# Altium project Piano.PrjPcb
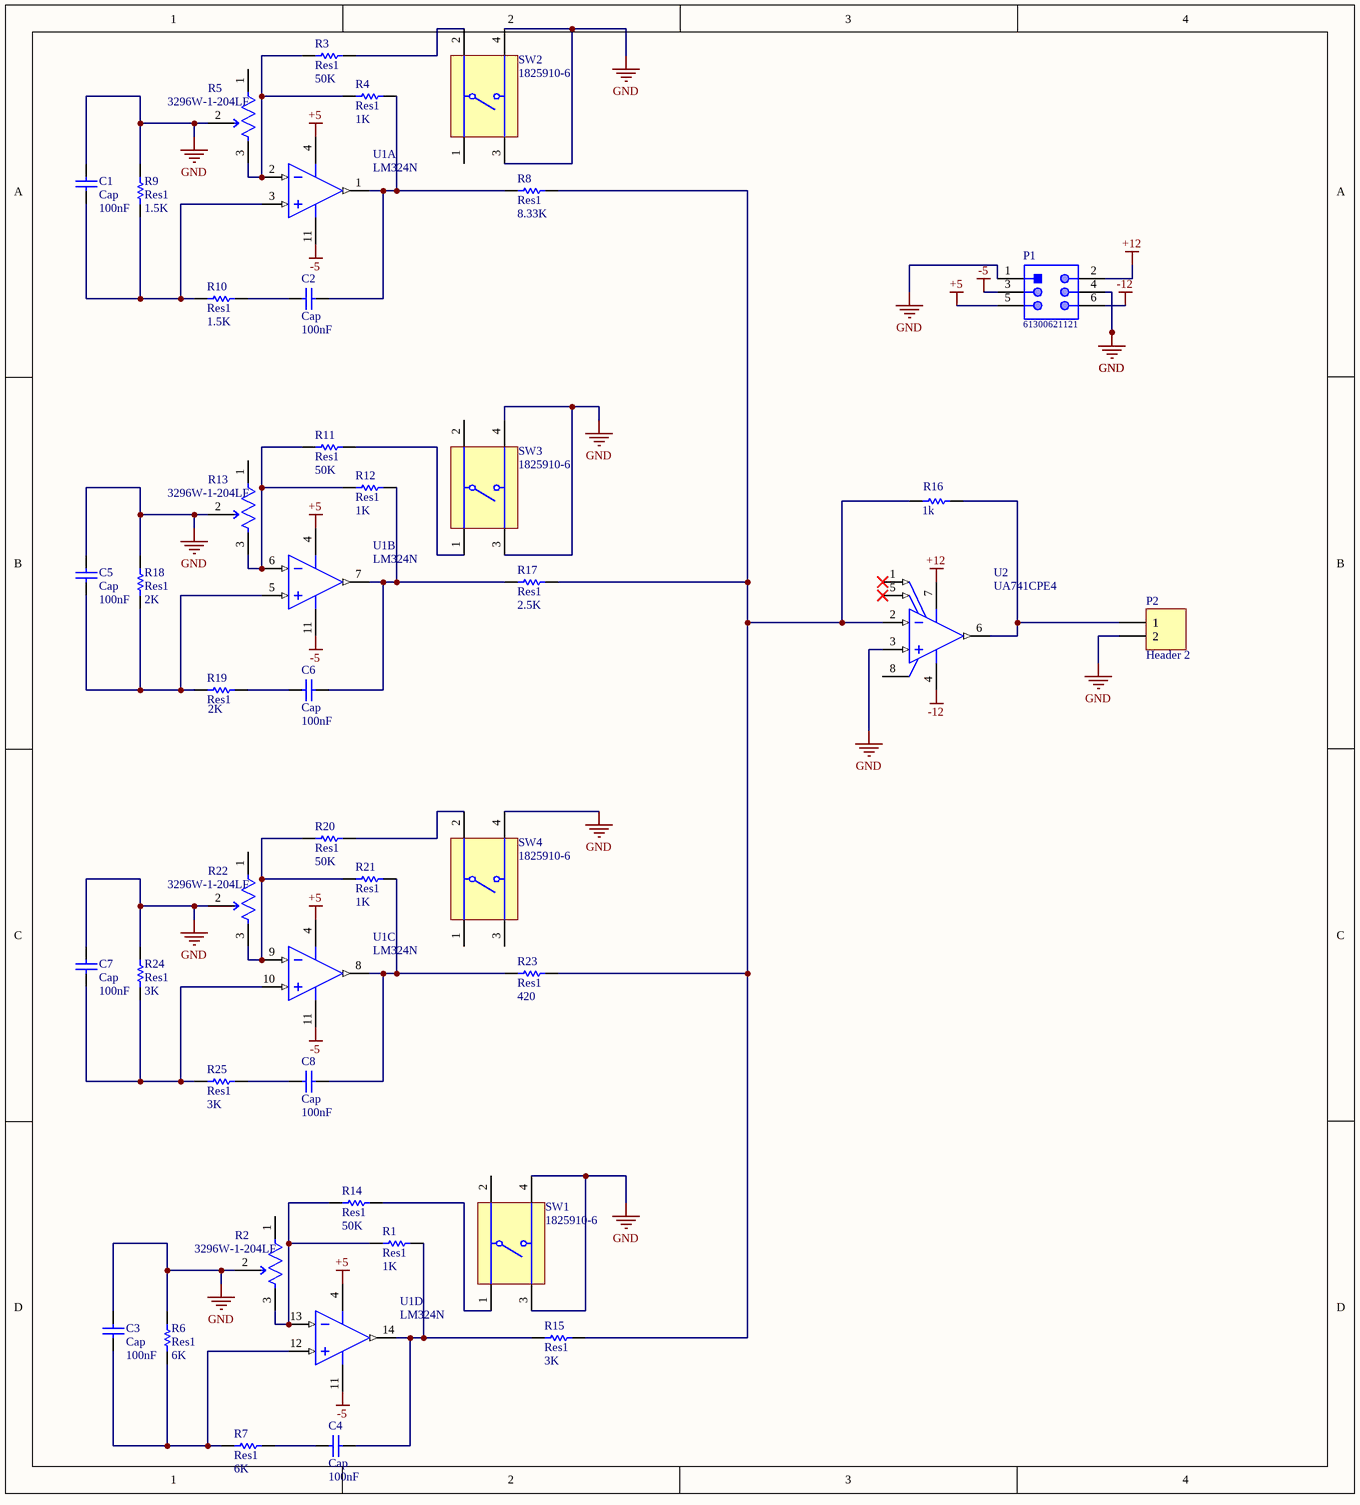
[diagram p0: Sheet1.SchDoc]
1 sheet, 41 parts. Net scope: global (net labels, ports and power ports of the same name join across sheets).
Board file: PCB2.PcbDoc

## Sheet Sheet1.SchDoc: Oscillators
size 254 x 279 mm; Author: Chathushka Priyanath; Revision: 1

### Parts
C1  Cap  value 100nF  [RAD-0.3]
C2  Cap  value 100nF  [RAD-0.3]
C3  Cap  value 100nF  [RAD-0.3]
C4  Cap  value 100nF  [RAD-0.3]
C5  Cap  value 100nF  [RAD-0.3]
C6  Cap  value 100nF  [RAD-0.3]
C7  Cap  value 100nF  [RAD-0.3]
C8  Cap  value 100nF  [RAD-0.3]
P1  61300621121  [61300621121]
P2  Header 2  [HDR1X2]
R1  Res1  value 1K  [AXIAL-0.3]
R2  3296W-1-204LF  [FP-3296W-MFG]
R3  Res1  value 50K  [AXIAL-0.3]
R4  Res1  value 1K  [AXIAL-0.3]
R5  3296W-1-204LF  [FP-3296W-MFG]
R6  Res1  value 6K  [AXIAL-0.3]
R7  Res1  value 6K  [AXIAL-0.3]
R8  Res1  value 8.33K  [AXIAL-0.3]
R9  Res1  value 1.5K  [AXIAL-0.3]
R10  Res1  value 1.5K  [AXIAL-0.3]
R11  Res1  value 50K  [AXIAL-0.3]
R12  Res1  value 1K  [AXIAL-0.3]
R13  3296W-1-204LF  [FP-3296W-MFG]
R14  Res1  value 50K  [AXIAL-0.3]
R15  Res1  value 3K  [AXIAL-0.3]
R16  1k  [RESA86-1060X240]
R17  Res1  value 2.5K  [AXIAL-0.3]
R18  Res1  value 2K  [AXIAL-0.3]
R19  Res1  value 2K  [AXIAL-0.3]
R20  Res1  value 50K  [AXIAL-0.3]
R21  Res1  value 1K  [AXIAL-0.3]
R22  3296W-1-204LF  [FP-3296W-MFG]
R23  Res1  value 420  [AXIAL-0.3]
R24  Res1  value 3K  [AXIAL-0.3]
R25  Res1  value 3K  [AXIAL-0.3]
SW1  1825910-6  [TECO-1825910-6_V]
SW2  1825910-6  [TECO-1825910-6_V]
SW3  1825910-6  [TECO-1825910-6_V]
SW4  1825910-6  [TECO-1825910-6_V]
U1  LM324N  [N0014A]  (parts A,B,C,D of 4)
U2  UA741CPE4  [TI-P8]

### Nets
+5: P1.5 U1.4(V+)
+12: P1.2 U2.7(VCC+)
-5: P1.3 U1.11(GND)
-12: P1.6 U2.4(VCC-)
GND: C1.2 C3.2 C5.2 C7.2 P1.1 P1.4 P2.2 R2.2(WIPER) R5.2(WIPER) R6.2 R9.2 R13.2(WIPER) R18.2 R22.2(WIPER) R24.2 SW1.3 SW1.4 SW2.3 SW2.4 SW3.3 SW3.4 SW4.4 U2.3(IN+)
NetC1_1: C1.1 R9.1 R10.1 U1.3(IN1+)
NetC2_1: C2.1 R10.2
NetC2_2: C2.2 R4.1 R8.2 U1.1(OUT1)
NetC3_1: C3.1 R6.1 R7.1 U1.12(IN4+)
NetC4_1: C4.1 R7.2
NetC4_2: C4.2 R1.1 R15.2 U1.14(OUT4)
NetC5_1: C5.1 R18.1 R19.1 U1.5(IN2+)
NetC6_1: C6.1 R19.2
NetC6_2: C6.2 R12.1 R17.2 U1.7(OUT2)
NetC7_1: C7.1 R24.1 R25.1 U1.10(IN3+)
NetC8_1: C8.1 R25.2
NetC8_2: C8.2 R21.1 R23.2 U1.8(OUT3)
NetP2_1: P2.1 R16.2 U2.6(OUT)
NetR1_2: R1.2 R2.3(CW) R14.2 U1.13(IN4-)
NetR3_1: R3.1 SW2.2
NetR3_2: R3.2 R4.2 R5.3(CW) U1.2(IN1-)
NetR8_1: R8.1 R15.1 R16.1 R17.1 R23.1 U2.2(IN-)
NetR11_1: R11.1 SW3.1
NetR11_2: R11.2 R12.2 R13.3(CW) U1.6(IN2-)
NetR14_1: R14.1 SW1.1
NetR20_1: R20.1 SW4.2
NetR20_2: R20.2 R21.2 R22.3(CW) U1.9(IN3-)

Not connected (* = marked no-connect by the designer): R2 1(CCW); R5 1(CCW); R13 1(CCW); R22 1(CCW); SW1 2; SW2 1; SW3 2; SW4 1 3; U2 1(OFFSET_N1)* 5(OFFSET_N2)* 8(NC)

### Library data of the parts
C1-C8 = Cap: Capacitor; Published: 8-Jun-2000; LatestRevisionDate: 17-Jul-2002; LatestRevisionNote: Re-released for DXP Platform.; PackageReference: RAD-0.3; Publisher: Altium Limited; PackageDescription: Radial Cap, Thru-Hole; 2 Leads; 0.3 in Pin Spacing
P1 = CMP-1502-01072-1: THT Vertical Pin Header WR-PHD, Pitch 2.54 mm, Dual Row, 6 pins; Manufacturer: Wurth Elektronik; Contact Resistance: 20mOhm; Withstanding Voltage: 500VAC; Pin Number: 6; Gender: Male; Pitch: 2.54mm; Working Voltage: 250VAC; Rated Current: 3A; Packaging: Bag; Row Number: Dual; Manufacturer URL: http://www.we-online.de; Part Number: 61300621121; Operating Temperature: -40to105degC; Mounting Technology: THT; Package Reference: 61300621121; Datasheet URL: https://katalog.we-online.de/em/datasheet/6130xx21121.pdf; Orientation: Vertical; Publisher: WurthElektronik
P2 = Header 2: Header, 2-Pin; LatestRevisionDate: 17-Jul-2002; LatestRevisionNote: Re-released for DXP Platform.; Publisher: Altium Limited
R1 R3 R4 R6-R12 R14 R15 R17-R21 R23-R25 = Res1: Resistor; Published: 8-Jun-2000; LatestRevisionDate: 17-Jul-2002; LatestRevisionNote: Re-released for DXP Platform.; PackageReference: AXIAL-0.3; Publisher: Altium Limited; PackageDescription: Axial Device, Thru-Hole; 2 Leads; 0.3 in Pin Spacing
R2 R5 R13 R22 = CMP-07234-000048-1: TRIMMER 200K OHM 0.5W PC PIN TOP; Resistance Tolerance: 10%; Number of Turns: 25; Temperature Coefficient: 100ppm/°C; Power Rating: 500mW; Resistance: 200kR; Resistor Type: Cermet; Color: Blue; Radiation Hardening: No; RoHS Compliant: Yes; Taper: Linear; Technology: CERMET; Mount: Panel; Packaging: Rail/Tube; Lead Free: Lead Free; Tolerance: 10%; Min Operating Temperature: -55°C; Depth: 4.83mm; Length: 9.53mm; Width: 9.53mm; REACH SVHC: No SVHC; Package Quantity: 50; Height: 0.395inch; Max Power Dissipation: 500mW; Max Operating Temperature: 125°C; Military Standard: Not; Termination: Pin; Contact Plating: Tin; Series: 3296; Weight: 0.03oz
R16 = CMP-1678-00005-1: Axial Resistor, 50 mOhm, +/- 1%, 2 W, -55 to 275 degC, 2-Pin THD, RoHS, Bulk; Bandwidth: 700 KHz; Nominal Supply Voltage: 12 V; Min Dual Supply Voltage: 1.5 V; Output Current: 30 mA; Max Dual Supply Voltage: 16 V; Case\Package: SOIC; Slew Rate: 0.3 V\us; Nominal Voltage Gain: 100 dB; Nominal Supply Current: 1.2 mA; Common Mode Rejection Ratio: 65 dB; Channels: 2; Radiation Hardening: No; Unity Gain Bandwidth Product: 700 KHz; Pins: 8; RoHSCompliant: true; ComponentLink2Description: Datasheet; Nominal Gain Bandwith Product: 700 KHz; Package Quantity: 1; PackageReference: 12FR050E; Min Operating Temperature: 0 degC; PackageDescription: 2-Pin Axial Lead, Dia 2.4 mm, Body Length 10.6 mm; Packaging: Cut Tape; Mount: Surface Mount; Nominal Dual Supply Voltage: 12 V; Min Supply Voltage: 1.5 V; Max Supply Voltage: 16 V; DatasheetVersion: Jun-15; ComponentLink1Description: Manufacturer URL; Max Operating Temperature: 70 degC; ComponentLink1URL: http://www.ohmite.com/; REACH SVHC: No SVHC; ComponentLink2URL: http://www.ohmite.com/cat/res_10.pdf; Height: 1.58 mm; Width: 3.91 mm; Length: 4.9 mm
SW1-SW4 = CMP-1684-00021-1: Tact Switch, SPST-NO, 0.05 A, -35 to 85 degC, 4-Pin THD, RoHS, Bulk; Manufacturer: TE Connectivity; Maximum Contact Resistance: 100mOhm; Mechanical Life: 100000Cycles; Bushing Type: Unthreaded; Switch Configuration: OFF(ON); Maximum DC Voltage Rating: 24V; Contact Rating @ Voltage: 0.05A@24VDC; Actuator Color: Black; Body Orientation: Straight; Function: MomentaryContact; Illumination: N/R; Actuator Style: RoundButton; Actuator Material: PolybutyleneTerephthalate; Dielectric Strength: 500VAC; Pole Throw Configuration: SPST; Actuator Length: 1.4mm; Product Weight: N/A; Contact Material: CopperAlloy; Housing Material: N/A; Terminal Type: PCPins; Minimum Insulation Resistance: 100MOhm; Package Description: 4-Pin Through Hole Device, Body 5.99 x 5.99 mm, Pitch 6.5 mm; Part No: 1825910-6; Package Reference: THD; Base Material: N/A; Manufacturer URL: http://www.te.com; Contact Plating: Silver; RoHS: Yes; Datasheet Version: Rev. C9; Electrical Life: 100000Cycles; Maximum AC Voltage Rating: N/A; Thread Size: N/R; Operating Temperature: -35to85C; Mounting: ThroughHole; Dimension: 5.99x5mm; Datasheet URL: http://www.te.com/commerce/DocumentDelivery/DDEController?Action=showdoc&DocId=Customer+Drawing%7F1825910%7FC9%7Fpdf%7FEnglish%7FENG_CD_1825910_C9.pdf%7F1825910-6; Family: 1825910; Seal Location: N/A; Seal Description: N/A; Packaging: N/A
U1 = CMP-0055-00082-3: Low Power Quad Operational Amplifier, 14-pin MDIP; Manufacturer: Texas Instruments; CompType: Amplifiers; PowerWise: N; PackageTopMarking: NSUZXYYTTE#*LM324N; PackageDescription: MDIP, .750 x .250 x.130in, 14 Lead, .100in Pitch; Package Reference: N0014A; RoHS: N; Code_JEDEC: MS-001-AA; ComponentLink1URL: http://www.ti.com/general/docs/lit/getliterature.tsp?genericPartNumber=LM324&fileType=pdf; ComponentLink1Description: Datasheet URL; PinCount: 14
U2 = CMP-0017-00974-1: General-Purpose Operational Amplifier, 7 to 36 V, 0 to 70 degC, 8-pin DIP (P8), Pb-Free (RoHS); Manufacturer: Texas Instruments; Total Supply Voltage(Min)(+5V is 5, +/-5V is 10): 7; GBW(Typ)(MHz): 1; Sub Family: General Purpose Amplifier, High Supply Voltage Amplifier (>=30V); Slew Rate(Typ)(V/us): 0.5; Vio (25C)(Max)(mV): 6; Iq per channel(Max)(mA): 2.8; CMRR(Min)(dB): 70; Total Supply Voltage(Max)(+5V is 5, +/-5V is 10): 36; IIB(Max)(pA): 1500000; ComponentLink2Description: Datasheet; PackageReference: P8; ComponentLink3Description: Package Specification; Number of Channels: 1; ComponentLink1Description: Manufacturer URL; ComponentLink3URL: http://www.ti.com/litv/pdf/mpdi001b; Code_JEDEC: MS-001; Eco-Plan: Pb-Free (RoHS); DatasheetVersion: SLOS094B; PackageVersion: 4040082/E, 04/2010; PartNumber: UA741CPE4; Mounting Technology: Through Hole; PackageDescription: 8-Pin Plastic In-Line, Body 9.59 x 6.35 mm, Pitch 2.54 mm; ComponentLink2URL: http://www.ti.com/lit/ds/symlink/ua741.pdf; ComponentLink1URL: http://www.ti.com/